# Altium project PCB_Project1.PrjPCB
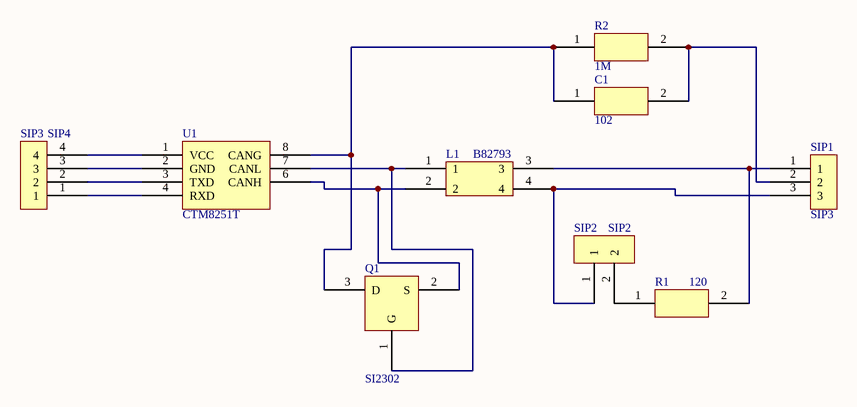
[diagram p0: Sheet1.SchDoc]
1 sheet, 9 parts. Net scope: global (net labels, ports and power ports of the same name join across sheets).
Board file: PCB1.PcbDoc

## Sheet Sheet1.SchDoc
size A4

### Parts
C1  102  [RES-T]
L1  B82793  [B82793]
Q1  SI2302  [SI2302]
R1  120  [RES-T]
R2  1M  [RES-T]
SIP1  SIP3  [SIP3]
SIP2  SIP2  [SIP2]
SIP3  SIP4  [SIP4]
U1  CTM8251T  [CTM8251T]

### Nets
NetC1_1: C1.1 Q1.3(D) R2.1 U1.8(CANG)
NetC1_2: C1.2 R2.2 SIP1.2
NetL1_1: L1.1 Q1.1(G) U1.7(CANL)
NetL1_2: L1.2 Q1.2(S) U1.6(CANH)
NetL1_3: L1.3 R1.2 SIP1.1
NetL1_4: L1.4 SIP1.3 SIP2.1
NetR1_1: R1.1 SIP2.2
NetSIP3_1: SIP3.1 U1.4(RXD)
NetSIP3_2: SIP3.2 U1.3(TXD)
NetSIP3_3: SIP3.3 U1.2(GND)
NetSIP3_4: SIP3.4 U1.1(VCC)

### Library data of the parts
C1 R1 R2 = RES-T